# Altium schematic sheet 04-LogicAND.SchDoc
size A4
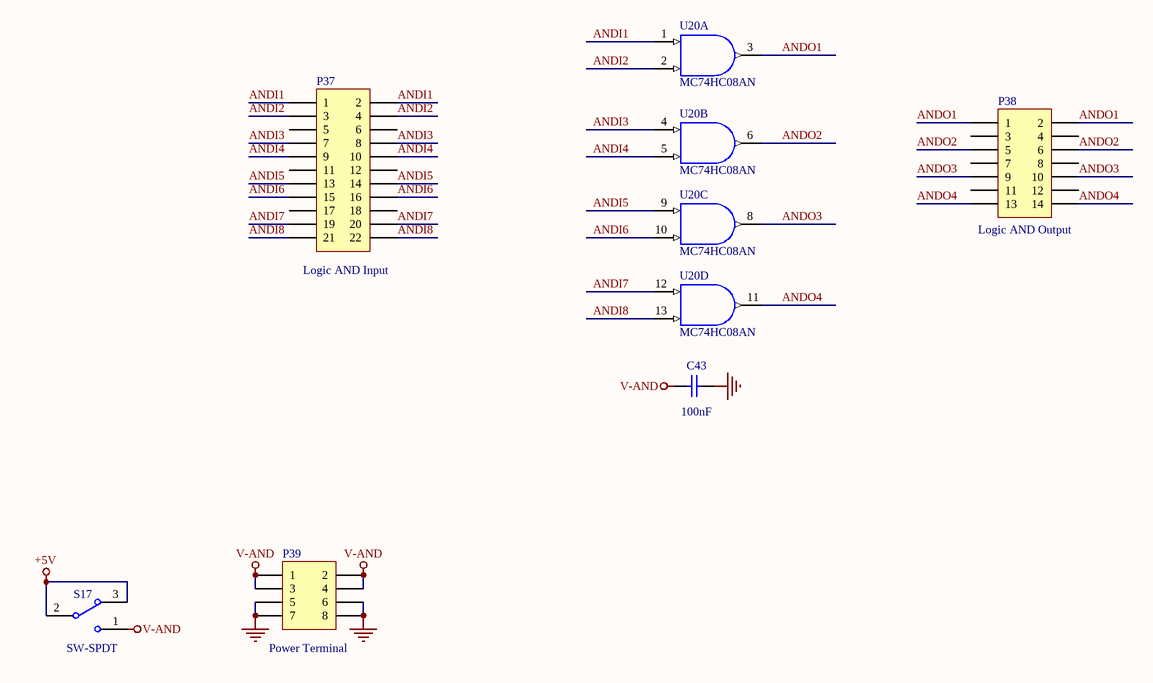
[diagram p0: 04-LogicAND.SchDoc]

## Parts
C43  value 100nF  [C-0805]  (hidden comment: 104)
P37  value Logic AND Input  [HDR2X11]  (hidden comment: Header 11X2)
P38  value Logic AND Output  [HDR2X7]  (hidden comment: H7X2)
P39  Publisher: Power Terminal  [HDR2X4]  (hidden comment: Header 4X2)
S17  SW-SPDT  [SW-DIP1SMD]
U20  MC74HC08AN  [SK-DIP14-300]  (parts A,B,C,D of 4)

## Nets
+5V: S17.2 S17.3
GND: C43.2 P39.5 P39.6 P39.7 P39.8 U20.7(GND)
V-AND: C43.1 P39.1 P39.2 P39.3 P39.4 S17.1
VDD: U20.14(V-AND)
ANDI1: P37.1 P37.2 U20.1(A)
ANDI2: P37.3 P37.4 U20.2(B)
ANDI3: P37.7 P37.8 U20.4(A)
ANDI4: P37.9 P37.10 U20.5(B)
ANDI5: P37.13 P37.14 U20.9(A)
ANDI6: P37.15 P37.16 U20.10(B)
ANDI7: P37.19 P37.20 U20.12(A)
ANDI8: P37.21 P37.22 U20.13(B)
ANDO1: P38.1 P38.2 U20.3(Y)
ANDO2: P38.5 P38.6 U20.6(Y)
ANDO3: P38.9 P38.10 U20.8(Y)
ANDO4: P38.13 P38.14 U20.11(Y)

Not connected (* = marked no-connect by the designer): P37 5 6 11 12 17 18; P38 3 4 7 8 11 12

## Library data of the parts
C43 = Cap: Capacitor; Published: 8-Jun-2000; LatestRevisionDate: 17-Jul-2002; LatestRevisionNote: Re-released for DXP Platform.; PackageReference: RAD-0.3; Publisher: Altium Limited; PackageDescription: Radial Cap, Thru-Hole; 2 Leads; 0.3 in Pin Spacing
P37 = Header 11X2: Header, 11-Pin, Dual row; LatestRevisionDate: 17-Jul-2002; LatestRevisionNote: Re-released for DXP Platform.
P38 = Header 7X2: Header, 7-Pin, Dual row; LatestRevisionDate: 17-Jul-2002; LatestRevisionNote: Re-released for DXP Platform.
P39 = Header 4X2: Header, 4-Pin, Dual row; LatestRevisionDate: 17-Jul-2002; LatestRevisionNote: Re-released for DXP Platform.
S17 = SW-SPDT: SPDT Subminiature Toggle Switch, Right Angle Mounting, Vertical Actuation; Published: 24-Mar-1999; LatestRevisionDate: 17-Dec-2003; LatestRevisionNote: Schematic revised, PCB Footprint replaced.; DatasheetVersion: 05-Dec-2000; PackageReference: TL36WW15050; Publisher: Altium Limited; PackageDescription: Switch; 4 Leads; ComponentLink1Description: Manufacturer Link; ComponentLink1URL: http://www.apem.com
U20 = MC74HC08AN: Quad 2-Input AND Gate; Published: 17-Jul-2002; LatestRevisionDate: 06-Jun-2005; LatestRevisionNote: Stylized 3D Model Added; DatasheetVersion: 1989; PackageVersion: 1997; PackageReference: 646-06; Publisher: Altium Limited; PackageDescription: DIP; 14 Leads; Row Spacing 7.62 mm; Pitch 2.54 mm; ComponentLink1Description: Manufacturer Link; ComponentLink1URL: http://www.onsemi.com/site/products/parametrics/0,4446,247,00.html; ComponentLink2Description: Ibis Model; ComponentLink2URL: http://www.onsemi.com/pub/Collateral/MC54HC08AJ.IBS